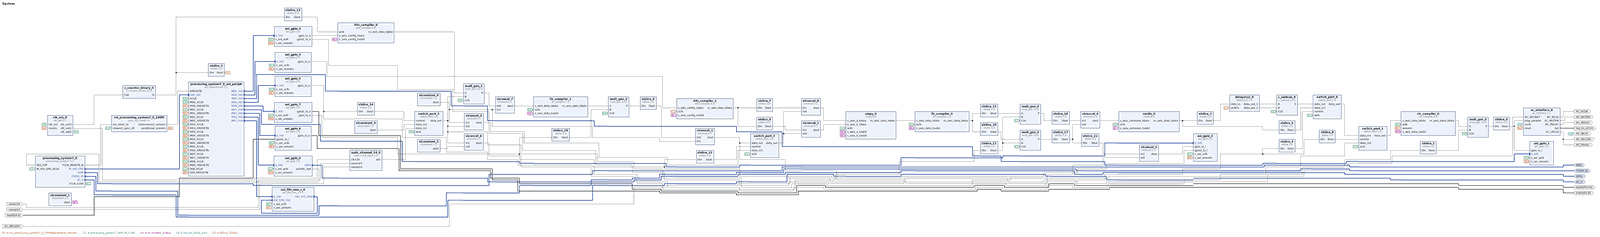
[diagram p0: block diagram of the top level, whole]
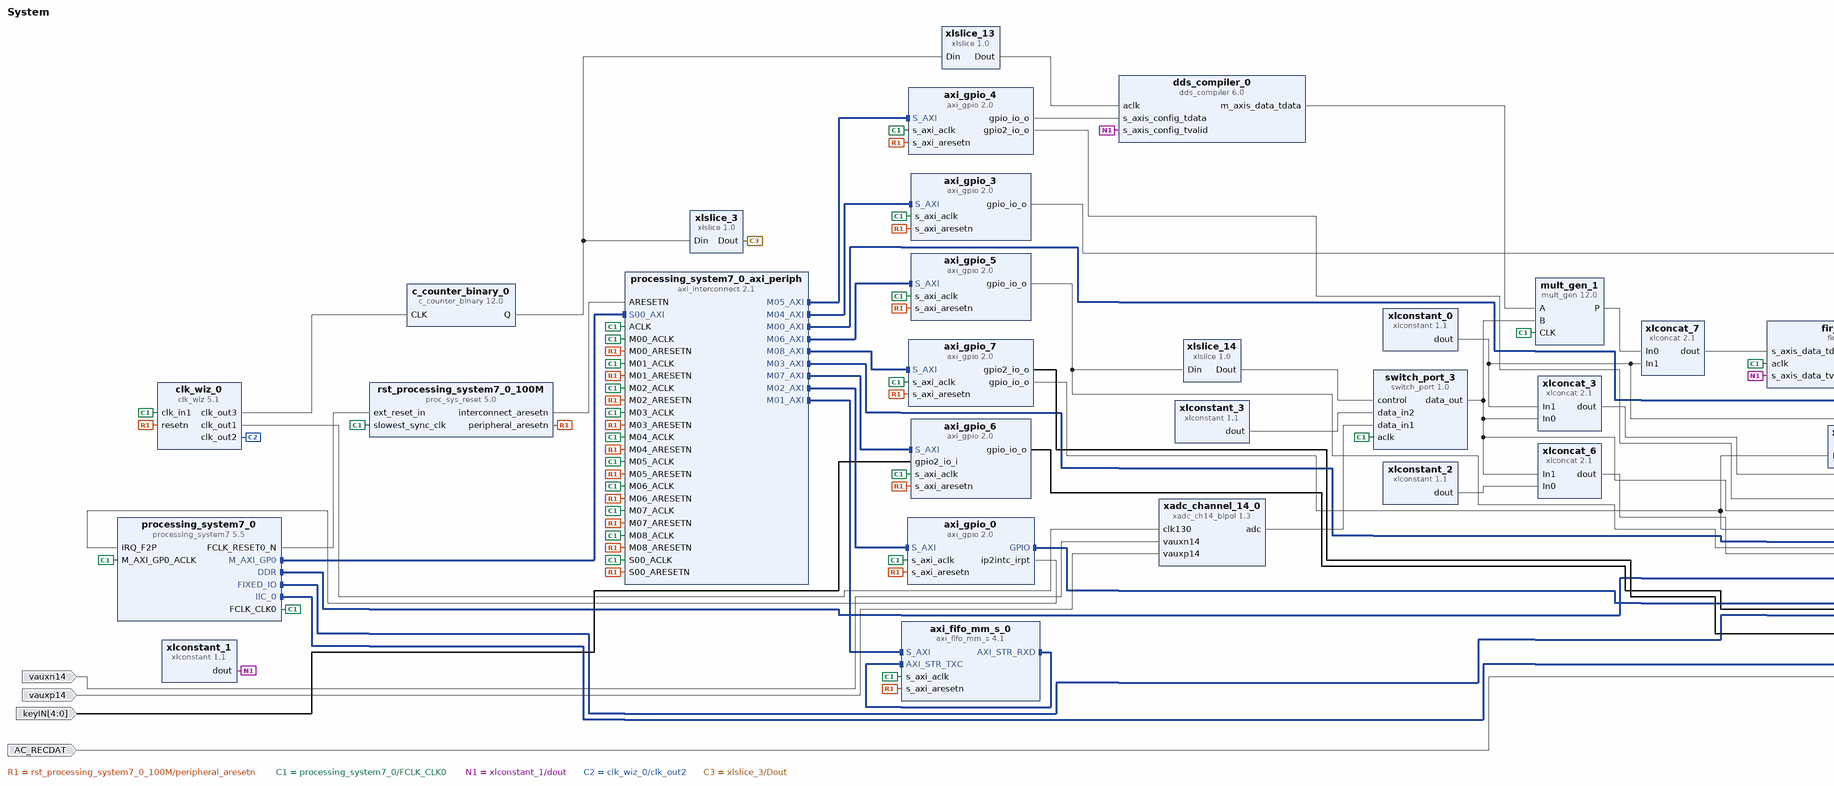
[diagram p1: block diagram of the top level, left part]
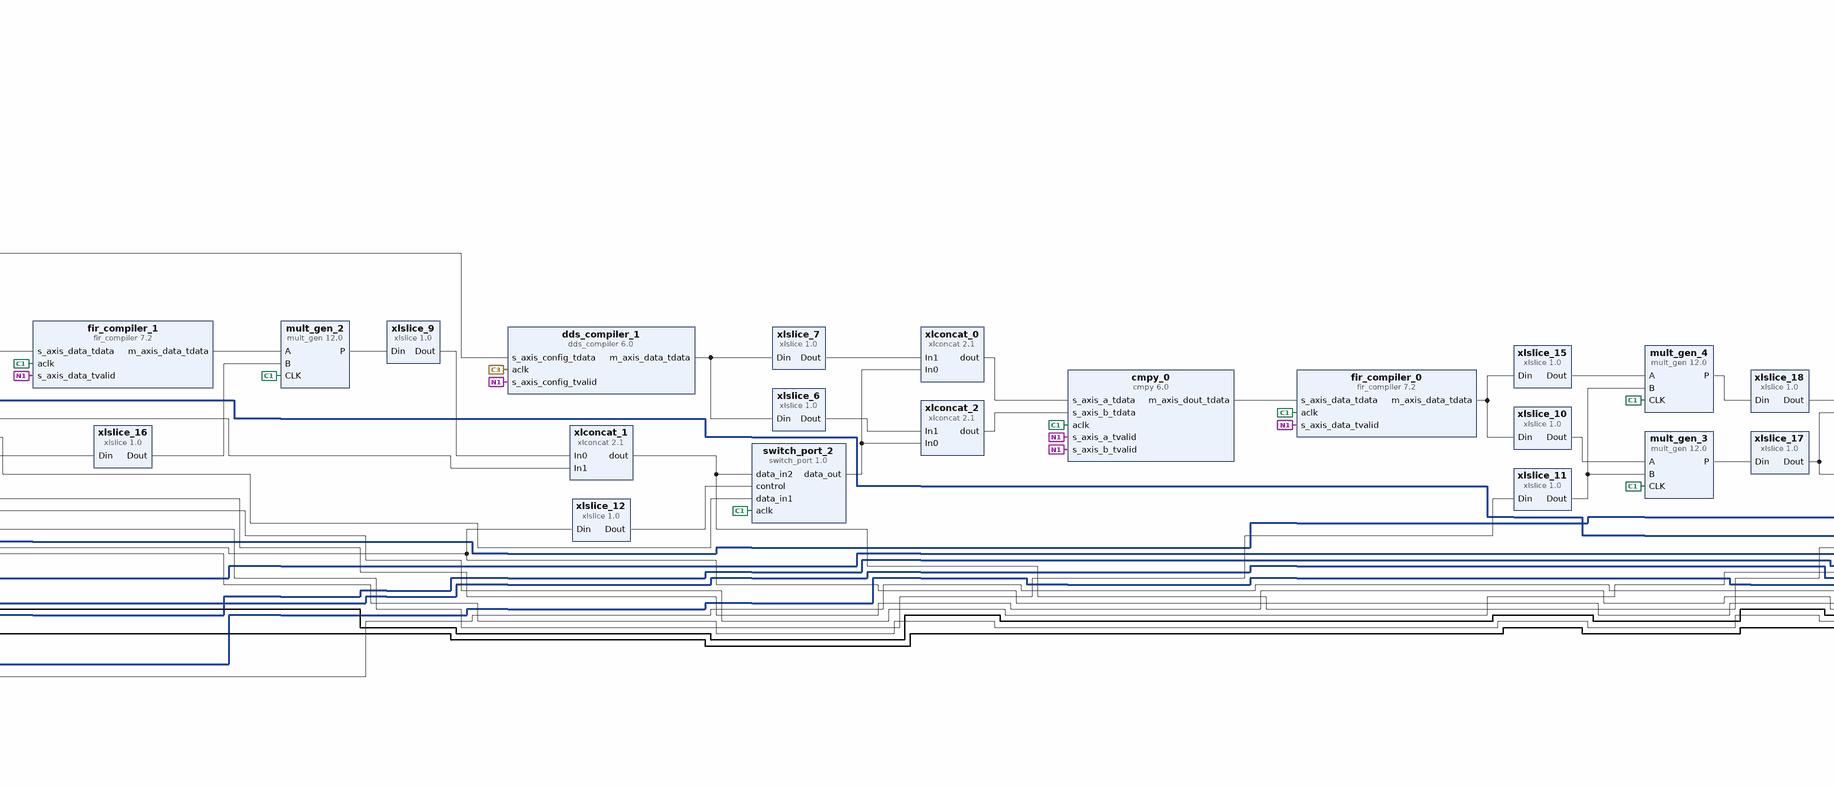
[diagram p2: block diagram of the top level, centre part]
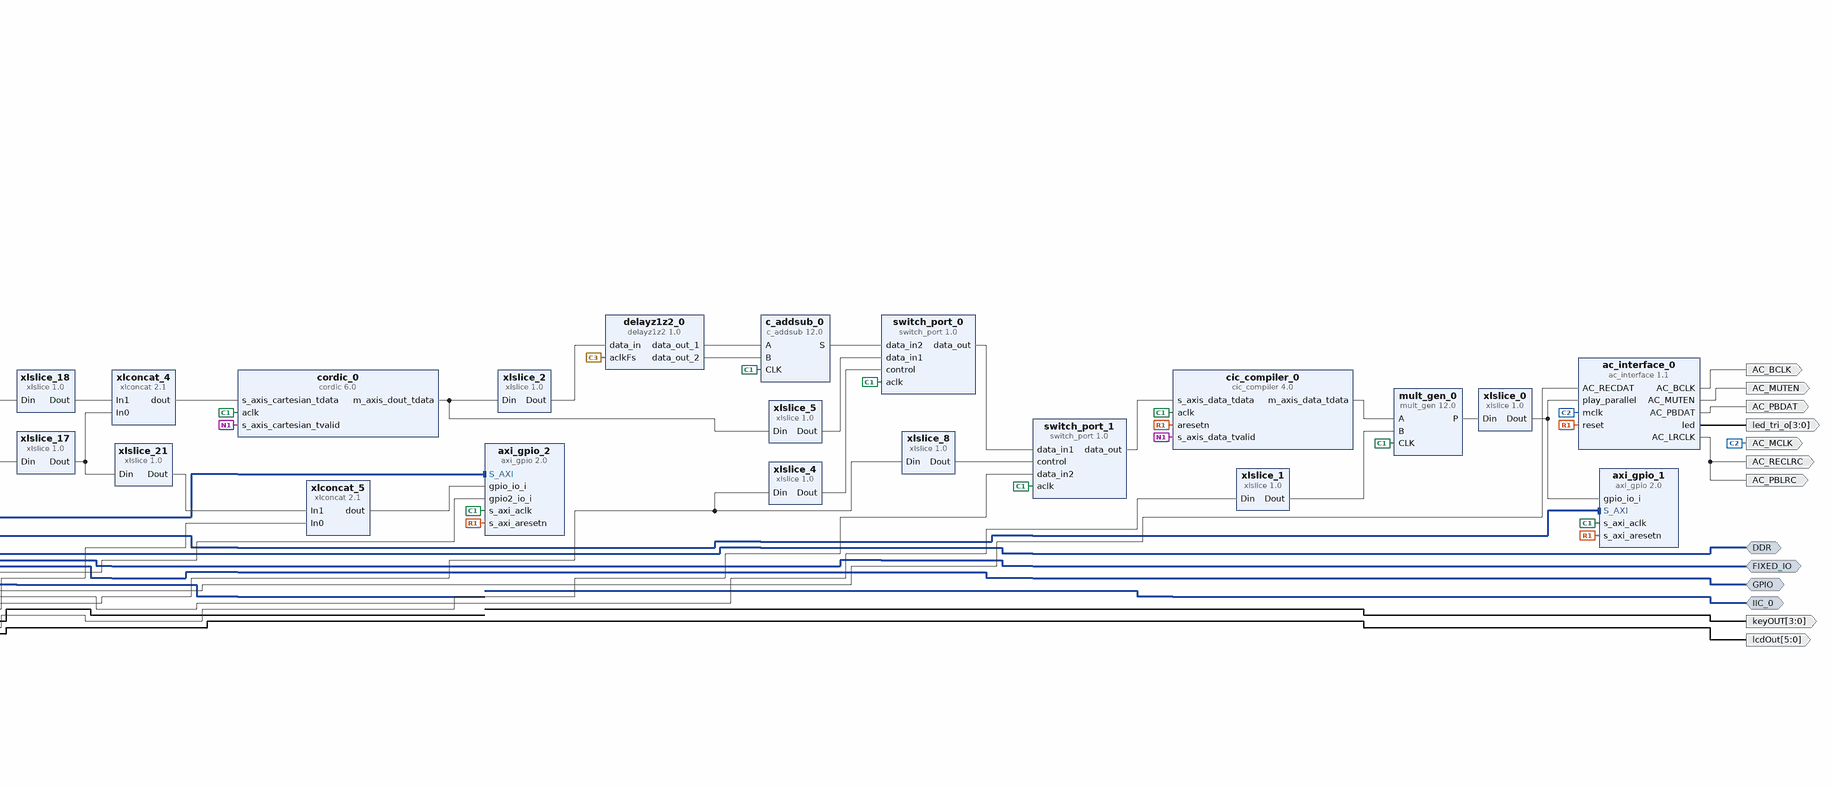
[diagram p3: block diagram of the top level, right part]
# Vivado block design System, Vivado 2014.4
create_bd_design System

create_bd_intf_port -mode Master -vlnv xilinx.com:interface:ddrx_rtl:1.0 DDR
create_bd_intf_port -mode Master -vlnv xilinx.com:display_processing_system7:fixedio_rtl:1.0 FIXED_IO
create_bd_intf_port -mode Master -vlnv xilinx.com:interface:gpio_rtl:1.0 GPIO
create_bd_intf_port -mode Master -vlnv xilinx.com:interface:iic_rtl:1.0 IIC_0
create_bd_port -dir I vauxn14
create_bd_port -dir I vauxp14
create_bd_port -dir O AC_MCLK
create_bd_port -dir O -from 3 -to 0 led_tri_o
create_bd_port -dir O AC_BCLK
create_bd_port -dir O AC_MUTEN
create_bd_port -dir O AC_PBDAT
create_bd_port -dir O AC_PBLRC
create_bd_port -dir O AC_RECLRC
create_bd_port -dir I AC_RECDAT
create_bd_port -dir O -from 3 -to 0 keyOUT
create_bd_port -dir I -from 4 -to 0 keyIN
create_bd_port -dir O -from 5 -to 0 lcdOut

create_bd_cell -type ip -vlnv xilinx.com:ip:axi_gpio:2.0 axi_gpio_0
set_property -dict {CONFIG.C_GPIO_WIDTH 4 CONFIG.C_ALL_INPUTS 1 CONFIG.C_INTERRUPT_PRESENT 1} [get_bd_cells axi_gpio_0]
create_bd_cell -type ip -vlnv xilinx.com:ip:processing_system7:5.5 processing_system7_0
set_property -dict [list \
  CONFIG.PCW_USE_FABRIC_INTERRUPT 1 \
  CONFIG.PCW_IRQ_F2P_INTR 1 \
  CONFIG.PCW_IMPORT_BOARD_PRESET {R:/Dropbox/Hobby/Programme/ZyBo/Dateien ZyBo/System.xml} \
  CONFIG.PCW_QSPI_PERIPHERAL_ENABLE 1 \
  CONFIG.PCW_ENET0_PERIPHERAL_ENABLE 0 \
  CONFIG.PCW_SD0_PERIPHERAL_ENABLE 0 \
  CONFIG.PCW_USB0_PERIPHERAL_ENABLE 0 \
  CONFIG.PCW_I2C0_PERIPHERAL_ENABLE 1 \
] [get_bd_cells processing_system7_0]
# 3 more settings of processing_system7_0 are not shown: defaults, MIO pin electricals, DDR timing, and values the tool derives
create_bd_cell -type ip -vlnv xilinx.com:ip:proc_sys_reset:5.0 rst_processing_system7_0_100M
create_bd_cell -type ip -vlnv xilinx.com:ip:axi_fifo_mm_s:4.1 axi_fifo_mm_s_0
set_property -dict {CONFIG.C_HAS_AXIS_TDEST false} [get_bd_cells axi_fifo_mm_s_0]
create_bd_cell -type ip -vlnv xilinx.com:ip:axi_interconnect:2.1 processing_system7_0_axi_periph
set_property -dict {CONFIG.NUM_MI 9} [get_bd_cells processing_system7_0_axi_periph]
create_bd_cell -type ip -vlnv xilinx.com:ip:axi_gpio:2.0 axi_gpio_1
set_property -dict {CONFIG.C_GPIO_WIDTH 32 CONFIG.C_ALL_INPUTS 1} [get_bd_cells axi_gpio_1]
create_bd_cell -type ip -vlnv xilinx.com:ip:axi_gpio:2.0 axi_gpio_3
set_property -dict {CONFIG.C_GPIO_WIDTH 16 CONFIG.C_ALL_INPUTS 0 CONFIG.C_ALL_OUTPUTS 1} [get_bd_cells axi_gpio_3]
create_bd_cell -type ip -vlnv xilinx.com:ip:axi_gpio:2.0 axi_gpio_2
set_property -dict [list \
  CONFIG.C_GPIO_WIDTH 32 \
  CONFIG.C_GPIO2_WIDTH 12 \
  CONFIG.C_IS_DUAL 1 \
  CONFIG.C_ALL_INPUTS 1 \
  CONFIG.C_ALL_INPUTS_2 1 \
] [get_bd_cells axi_gpio_2]
create_bd_cell -type ip -vlnv xilinx.com:ip:xlconstant:1.1 xlconstant_1
create_bd_cell -type ip -vlnv xilinx.com:ip:axi_gpio:2.0 axi_gpio_4
set_property -dict [list \
  CONFIG.C_GPIO_WIDTH 16 \
  CONFIG.C_GPIO2_WIDTH 32 \
  CONFIG.C_IS_DUAL 1 \
  CONFIG.C_ALL_OUTPUTS 1 \
  CONFIG.C_ALL_OUTPUTS_2 1 \
] [get_bd_cells axi_gpio_4]
create_bd_cell -type ip -vlnv xilinx.com:ip:axi_gpio:2.0 axi_gpio_5
set_property -dict {CONFIG.C_GPIO_WIDTH 4 CONFIG.C_ALL_OUTPUTS 1} [get_bd_cells axi_gpio_5]
create_bd_cell -type ip -vlnv xilinx.com:ip:clk_wiz:5.1 clk_wiz_0
set_property -dict [list \
  CONFIG.PRIMITIVE MMCM \
  CONFIG.CLKOUT2_USED true \
  CONFIG.CLKOUT3_USED true \
  CONFIG.NUM_OUT_CLKS 3 \
  CONFIG.CLKOUT1_REQUESTED_OUT_FREQ 130.000 \
  CONFIG.CLKOUT1_REQUESTED_PHASE 0.000 \
  CONFIG.CLKOUT2_REQUESTED_OUT_FREQ 12.288 \
  CONFIG.CLKOUT3_REQUESTED_OUT_FREQ 16.000 \
  CONFIG.USE_LOCKED false \
  CONFIG.USE_RESET true \
  CONFIG.RESET_TYPE ACTIVE_LOW \
  CONFIG.CLKOUT1_JITTER 224.856 \
  CONFIG.CLKOUT1_PHASE_ERROR 300.278 \
  CONFIG.CLKOUT2_JITTER 328.869 \
  CONFIG.CLKOUT2_PHASE_ERROR 300.278 \
  CONFIG.CLKOUT3_JITTER 312.084 \
  CONFIG.CLKOUT3_PHASE_ERROR 300.278 \
] [get_bd_cells clk_wiz_0]
create_bd_cell -type ip -vlnv Nolan:user:ac_interface:1.1 ac_interface_0
create_bd_cell -type ip -vlnv TD:user:xadc_ch14_bipol:1.3 xadc_channel_14_0
create_bd_cell -type ip -vlnv xilinx.com:ip:dds_compiler:6.0 dds_compiler_1
set_property -dict [list \
  CONFIG.DDS_Clock_Rate 2 \
  CONFIG.Parameter_Entry Hardware_Parameters \
  CONFIG.Noise_Shaping None \
  CONFIG.Phase_Width 16 \
  CONFIG.Output_Width 12 \
  CONFIG.Phase_Increment Programmable \
  CONFIG.Negative_Sine true \
  CONFIG.Has_Phase_Out false \
  CONFIG.Has_ARESETn false \
  CONFIG.PINC1 100000000000 \
] [get_bd_cells dds_compiler_1]
create_bd_cell -type ip -vlnv xilinx.com:ip:xlslice:1.0 xlslice_6
set_property -dict {CONFIG.DIN_FROM 15 CONFIG.DIN_WIDTH 32} [get_bd_cells xlslice_6]
create_bd_cell -type ip -vlnv xilinx.com:ip:xlslice:1.0 xlslice_7
set_property -dict {CONFIG.DIN_TO 16 CONFIG.DIN_FROM 31 CONFIG.DIN_WIDTH 32} [get_bd_cells xlslice_7]
create_bd_cell -type ip -vlnv xilinx.com:ip:xlslice:1.0 xlslice_3
set_property -dict {CONFIG.DIN_TO 2 CONFIG.DIN_FROM 2 CONFIG.DIN_WIDTH 8} [get_bd_cells xlslice_3]
create_bd_cell -type ip -vlnv xilinx.com:ip:cic_compiler:4.0 cic_compiler_0
set_property -dict [list \
  CONFIG.Filter_Type Decimation \
  CONFIG.Number_Of_Stages 3 \
  CONFIG.Sample_Rate_Changes Fixed \
  CONFIG.Fixed_Or_Initial_Rate 42 \
  CONFIG.Input_Sample_Frequency 2 \
  CONFIG.Clock_Frequency 100.0 \
  CONFIG.Input_Data_Width 32 \
  CONFIG.Quantization Truncation \
  CONFIG.Output_Data_Width 32 \
  CONFIG.HAS_ARESETN true \
] [get_bd_cells cic_compiler_0]
create_bd_cell -type ip -vlnv xilinx.com:ip:cordic:6.0 cordic_0
set_property -dict [list \
  CONFIG.Functional_Selection Translate \
  CONFIG.Pipelining_Mode Optimal \
  CONFIG.Phase_Format Scaled_Radians \
  CONFIG.Input_Width 32 \
  CONFIG.Output_Width 32 \
  CONFIG.Round_Mode Round_Pos_Neg_Inf \
] [get_bd_cells cordic_0]
create_bd_cell -type ip -vlnv xilinx.com:ip:xlslice:1.0 xlslice_5
set_property -dict {CONFIG.DIN_FROM 31 CONFIG.DIN_WIDTH 64} [get_bd_cells xlslice_5]
create_bd_cell -type ip -vlnv xilinx.com:ip:cmpy:6.0 cmpy_0
set_property -dict [list \
  CONFIG.APortWidth 12 \
  CONFIG.BPortWidth 12 \
  CONFIG.RoundMode Truncate \
  CONFIG.OutputWidth 24 \
] [get_bd_cells cmpy_0]
create_bd_cell -type ip -vlnv xilinx.com:ip:xlconcat:2.1 xlconcat_0
set_property -dict {CONFIG.IN0_WIDTH 16 CONFIG.IN1_WIDTH 16} [get_bd_cells xlconcat_0]
create_bd_cell -type ip -vlnv xilinx.com:ip:xlconcat:2.1 xlconcat_2
set_property -dict {CONFIG.IN0_WIDTH 16 CONFIG.IN1_WIDTH 16} [get_bd_cells xlconcat_2]
create_bd_cell -type ip -vlnv xilinx.com:ip:c_counter_binary:12.0 c_counter_binary_0
set_property -dict {CONFIG.Output_Width 8} [get_bd_cells c_counter_binary_0]
create_bd_cell -type ip -vlnv xilinx.com:ip:mult_gen:12.0 mult_gen_0
set_property -dict [list \
  CONFIG.PortAType Signed \
  CONFIG.PortAWidth 32 \
  CONFIG.PortBType Signed \
  CONFIG.PortBWidth 16 \
] [get_bd_cells mult_gen_0]
create_bd_cell -type ip -vlnv xilinx.com:ip:xlslice:1.0 xlslice_0
set_property -dict {CONFIG.DIN_FROM 31 CONFIG.DIN_WIDTH 48} [get_bd_cells xlslice_0]
create_bd_cell -type ip -vlnv xilinx.com:ip:xlslice:1.0 xlslice_1
set_property -dict {CONFIG.DIN_FROM 15} [get_bd_cells xlslice_1]
create_bd_cell -type ip -vlnv TD:user:switch_port:1.0 switch_port_0
set_property -dict {CONFIG.D_WIDTH 32} [get_bd_cells switch_port_0]
create_bd_cell -type ip -vlnv xilinx.com:ip:xlslice:1.0 xlslice_2
set_property -dict {CONFIG.DIN_TO 32 CONFIG.DIN_FROM 63 CONFIG.DIN_WIDTH 64} [get_bd_cells xlslice_2]
create_bd_cell -type ip -vlnv TD:user:delayz1z2:1.0 delayz1z2_0
set_property -dict {CONFIG.D_WIDTH 32} [get_bd_cells delayz1z2_0]
create_bd_cell -type ip -vlnv xilinx.com:ip:c_addsub:12.0 c_addsub_0
set_property -dict [list \
  CONFIG.A_Type Signed \
  CONFIG.B_Type Signed \
  CONFIG.A_Width 32 \
  CONFIG.B_Width 32 \
  CONFIG.Add_Mode Subtract \
  CONFIG.Out_Width 32 \
  CONFIG.CE false \
] [get_bd_cells c_addsub_0]
create_bd_cell -type ip -vlnv xilinx.com:ip:xlslice:1.0 xlslice_4
set_property -dict {CONFIG.DIN_WIDTH 4} [get_bd_cells xlslice_4]
create_bd_cell -type ip -vlnv xilinx.com:ip:axi_gpio:2.0 axi_gpio_6
set_property -dict [list \
  CONFIG.C_GPIO_WIDTH 4 \
  CONFIG.C_GPIO2_WIDTH 5 \
  CONFIG.C_IS_DUAL 1 \
  CONFIG.C_ALL_INPUTS_2 1 \
  CONFIG.C_ALL_OUTPUTS 1 \
] [get_bd_cells axi_gpio_6]
create_bd_cell -type ip -vlnv xilinx.com:ip:axi_gpio:2.0 axi_gpio_7
set_property -dict [list \
  CONFIG.C_GPIO_WIDTH 16 \
  CONFIG.C_GPIO2_WIDTH 6 \
  CONFIG.C_IS_DUAL 1 \
  CONFIG.C_ALL_OUTPUTS 1 \
  CONFIG.C_ALL_OUTPUTS_2 1 \
] [get_bd_cells axi_gpio_7]
create_bd_cell -type ip -vlnv TD:user:switch_port:1.0 switch_port_1
set_property -dict {CONFIG.D_WIDTH 32} [get_bd_cells switch_port_1]
create_bd_cell -type ip -vlnv xilinx.com:ip:xlslice:1.0 xlslice_8
set_property -dict {CONFIG.DIN_TO 1 CONFIG.DIN_FROM 1 CONFIG.DIN_WIDTH 4} [get_bd_cells xlslice_8]
create_bd_cell -type ip -vlnv xilinx.com:ip:xlconcat:2.1 xlconcat_6
set_property -dict {CONFIG.IN0_WIDTH 20 CONFIG.IN1_WIDTH 12} [get_bd_cells xlconcat_6]
create_bd_cell -type ip -vlnv xilinx.com:ip:xlconstant:1.1 xlconstant_2
set_property -dict {CONFIG.CONST_WIDTH 20 CONFIG.CONST_VAL 00000000000000000000} [get_bd_cells xlconstant_2]
create_bd_cell -type ip -vlnv xilinx.com:ip:fir_compiler:7.2 fir_compiler_1
set_property -dict [list \
  CONFIG.CoefficientSource Vector \
  CONFIG.CoefficientVector {-3.6422104847778761e-06, -1.7235236456349554e-06, -6.5605630122715771e-08, 1.3009683366130124e-06, 2.3545936956420433e-06, 3.0830197019838887e-06, 3.4835294156239235e-06, 3.5629129955667498e-06, 3.3372344875325201e-06, 2.8313960502360503e-06, 2.0785072865694044e-06, 1.1190709773849026e-06, -2.3035669289843903e-20, -1.2265165052400941e-06, -2.5042766338218733e-06, -3.7744350823556351e-06, -4.9769522293226605e-06, -6.0520948348810563e-06, -6.941958766077525e-06, -7.5919831410353323e-06, -7.9524247876477664e-06, -7.9797619524209215e-06, -7.637996789280011e-06, -6.8998273140827434e-06, -5.7476612272222929e-06, -4.1744462737819984e-06, -2.1842946083839896e-06, 2.0711806945961305e-07, 2.9723940834723496e-06, 6.0725073535803546e-06, 9.4571557486109325e-06, 1.3065374180715241e-05, 1.6826405379823742e-05, 2.0660820134894325e-05, 2.4481873598435841e-05, 2.8197079115782801e-05, 3.1709976058339652e-05, 3.4922063409739145e-05, 3.7734866474867545e-05, 4.0052100151439553e-05, 4.1781888815897691e-05, 4.2839000117721148e-05, 4.3147047928795297e-05, 4.2640618427624782e-05, 4.126727287052994e-05, 3.8989381058840429e-05, 3.5785740882826189e-05, 3.1652941623720675e-05, 2.6606431921308062e-05, 2.0681257444575258e-05, 1.3932438296593733e-05, 6.4349619829956904e-06, -1.71662570148009e-06, -1.0409042357418418e-05, -1.9511506049700093e-05, -2.8877382507870692e-05, -3.8346228888137883e-05, -4.774621211334551e-05, -5.6896871457633397e-05, -6.561218692445845e-05, -7.3703907250549069e-05, -8.0985084223964755e-05, -8.7273753597646284e-05, -9.239669736913084e-05, -9.6193217729953254e-05, -9.8518849697719474e-05, -9.9248937445209291e-05, -9.8281998728576636e-05, -9.554280266153747e-05, -9.0985088429025425e-05, -8.4593856398705567e-05, -7.6387168458873559e-05, -6.6417401242984365e-05, -5.4771904119677069e-05, -4.1573023327333199e-05, -2.6977464278693313e-05, -1.1174975690321365e-05, 5.6136483859398614e-06, 2.3139239549968569e-05, 4.1127576629809569e-05, 5.9283321971099997e-05, 7.7294523278261551e-05, 9.4837618991704383e-05, 0.00011158287303027423, 0.00012720015353816415, 0.00014136496030708613, 0.00015376459703940958, 0.00016410437779807935, 0.0001721137520509807, 0.00017755222982757064, 0.00018021498779602173, 0.00017993803863347753, 0.0001766028499522879, 0.00017014030526917186, 0.00016053390802420962, 0.00014782214038778257, 0.00013209990140495651, 0.00011351896374162415, 9.2287404694796181e-05, 6.8667984949938584e-05, 4.2975467513605548e-05, 1.5572888990203144e-05, -1.313318444862831e-05, -4.2698363811265622e-05, -7.2647034244331191e-05, -0.0001024797505048134, -0.00013168132117561868, -0.00015972945528416443, -0.00018610383028489836, -0.00021029542788216383, -0.00023181597420967307, -0.00025020731371743729, -0.00026505054197039127, -0.00027597472160703878, -0.00028266500805609093, -0.0002848700173180952, -0.00028240827717744647, -0.0002751736155424436, -0.00026313935507583995, -0.00024636120166932551, -0.00022497873536358163, -0.00019921543569277297, -0.00016937719875610247, -0.00013584933015852344, -9.9092025845925625e-05, -5.9634381282109975e-05, -1.8066997846714812e-05, 2.4966716768213299e-05, 6.8780430567221825e-05, 0.00011265580287305414, 0.00015585426171465928, 0.00019762945072104827, 0.00023724013594158896, 0.00027396334919782187, 0.00030710753461056425, 0.00033602545912352224, 0.00036012664637272227, 0.00037888909626274618, 0.00039187006015561839, 0.00039871565361962067, 0.0003991691050991078, 0.00039307745944120506, 0.0003803965796546894, 0.0003611943182028328, 0.00033565176009223656, 0.00030406247349203829, 0.00026682973902068536, 0.00022446176553937318, 0.00017756493762222323, 0.00012683517713695319, 7.3047537856419796e-05, 1.7044187021416604e-05, -4.0279039407094956e-05, -9.7987291100309828e-05, -0.00015512232412096398, -0.00021071882244896704, -0.00026382113674286743, -0.00031350014389790599, -0.00035886992337357568, -0.00039910394424031061, -0.00043345046057755417, -0.00046124682227795705, -0.00048193242339886308, -0.00049506003076606132, -0.0005003052612805851, -0.00049747400690652204, -0.00048650764112653024, -0.00046748587915084713, -0.00044062720568252957, -0.00040628682783419671, -0.00036495215606102081, -0.00031723586188060879, -0.0002638666068261048, -0.00020567758164808186, -0.00014359303737456283, -7.8613029612268855e-05, -1.1796633622672249e-05, 5.5756080511967759e-05, 0.00012292299657709824, 0.00018857948759914097, 0.00025161818573042285, 0.00031096862595286773, 0.00036561640112453938, 0.00041462147097205687, 0.00045713527956680201, 0.00049241635447406476, 0.00051984408585952369, 0.00053893041497507673, 0.00054932919810108511, 0.00055084305355479794, 0.00054342754504152415, 0.00052719260359175503, 0.0005024011416841492, 0.00046946486593271226, 0.00042893734790789656, 0.00038150446523611554, 0.00032797237604971323, 0.00026925323812874871, 0.00020634892871573084, 0.00014033306108296811, 7.2331628656130471e-05, 3.5026361096546596e-06, -6.4984901275665698e-05, -0.00013197219406484807, -0.00019633174796397694, -0.00025698786376859362, -0.00031293617443017087, -0.00036326184214679368, -0.0004071560623629581, -0.00044393055267872211, -0.00047302974237219147, -0.00049404042184575316, -0.00050669866000412772, -0.00051089385043876694, -0.00050666980331211893, -0.00049422285791594347, -0.00047389704987579786, -0.00044617642571340496, -0.00041167465477643539, -0.00037112214323374164, -0.00032535090578549177, -0.00027527749688717988, -0.0002218843436547153, -0.00016619985633164818, -0.00010927771851122391, -5.2175777609752957e-05, 4.0650340657823936e-06, 5.8441316206067154e-05, 0.00011000693163339093, 0.00015789144448430115, 0.00020131688327804253, 0.00023961247983200138, 0.00027222707559768138, 0.00029873893432850909, 0.00031886275314372718, 0.0003324537219796716, 0.0003395085429686751, 0.00034016338521545718, 0.0003346888154452746, 0.00032348180973278931, 0.00030705501462940845, 0.00028602348615000154, 0.00026108919096157635, 0.0002330236045125114, 0.00020264878462475185, 0.00017081733523894091, 0.00013839170269476614, 0.0001062232654516453, 7.5131686995882256e-05, 4.5885000522150403e-05, 1.9180882706859734e-05, -4.3704473941624384e-06, -2.4261299282590291e-05, -4.0099186928975313e-05, -5.161679345132192e-05, -5.867896457203439e-05, -6.1286533568400613e-05, -5.957684838780486e-05, -5.3820943442733242e-05, -4.4417372863673183e-05, -3.188279712590431e-05, -1.6839489389626262e-05, 1.7035977866319725e-19, 1.785071419707591e-05, 3.5875326284093986e-05, 5.3205916090441247e-05, 6.8967014319657621e-05, 8.2299402547212936e-05, 9.2384129662246667e-05, 9.8466188510870964e-05, 9.9877291439654737e-05, 9.6057190484819099e-05, 8.6573007207764726e-05, 7.1136068489170449e-05, 4.9615787555031394e-05, 2.2050183459279476e-05, -1.1347303713563979e-05, -5.0184971668441453e-05, -9.3894177879655822e-05, -0.00014173492718119735, -0.00019280573634100585, -0.0002460576933438418, -0.00030031253479878811, -0.00035428447188723297, -0.00040660540556029329, -0.00045585308724247793, -0.00050058170399799233, -0.00053935429876018567, -0.00057077637846231677, -0.00059353001720833186, -0.00060640772924064551, -0.00060834536840879137, -0.00059845330785892822, -0.00057604516619881867, -0.0005406633745888758, -0.0004921009228933713, -0.00043041868170329902, -0.00035595776990300626, -0.00026934652337804403, -0.00017150171804105731, -6.3623807905242771e-05, 5.2813945462671306e-05, 0.00017608245425852417, 0.0003042197735422461, 0.00043505980882920897, 0.00056626638790101356, 0.00069537220147877917, 0.00081982200274054997, 0.00093701934989814635, 0.001044376081531671, 0.0011393636332995111, 0.0012195652389728794, 0.0012827280102038594, 0.0013268138594452956, 0.0013500482200881959, 0.0013509655278956428, 0.0013284504585359281, 0.0012817739673975713, 0.0012106232494437756, 0.0011151248277655999, 0.00099586008845404866, 0.00085387270478037738, 0.00069066753343986753, 0.00050820071743717943, 0.00030886089143959612, 9.5441553221181318e-05, -0.00012889516390801842, -0.00036066291126215491, -0.00059610316260838309, -0.00083124413260076595, -0.0010619656862389793, -0.0012840692100455269, -0.0014933512917156969, -0.0016856799496040202, -0.0018570720690427691, -0.0020037706412711727, -0.0021223203644263598, -0.0022096401559116982, -0.0022630911423519888, -0.0022805387376094201, -0.0022604074908010689, -0.0022017274842403827, -0.0021041711845178543, -0.0019680797968311971, -0.0017944783409812675, -0.0015850788545233214, -0.0013422713313493812, -0.0010691022190599357, -0.00076924052213926176, -0.00044693178621543772, -0.00010694046742694325, 0.0002455185841006355, 0.00060485858069667228, 0.00096520804277707177, 0.0013205054944459146, 0.0016646001014652141, 0.0019913565992653597, 0.0022947627407832222, 0.0025690374056221567, 0.0028087374555899399, 0.0030088613988076109, 0.0031649479364287626, 0.0032731675130848806, 0.003330405074357981, 0.0033343323511103987, 0.0032834681399601614, 0.0031772252295342259, 0.0030159428307106858, 0.002800903602655982, 0.0025343346213365266, 0.0022193919091377814, 0.0018601284286690824, 0.0014614457358653632, 0.0010290297819859308, 0.00056927164578181831, 8.917426063972028e-05, -0.00040375352835577604, -0.00090161399088786775, -0.001396246806633625, -0.0018793626142045495, -0.0023426816305274515, -0.0027780750248181624, -0.0031777066374071004, -0.0035341725808398458, -0.0038406362505769235, -0.0040909563061903419, -0.0042798052613673698, -0.004402776441663544, -0.0044564772313899267, -0.0044386067330923224, -0.0043480162018535275, -0.0041847508884896873, -0.0039500722263324161, -0.0036464596208211153, -0.003277591444200775, -0.0028483051934405277, -0.0023645371319508551, -0.001833242098463958, -0.0012622945231313867, -0.00066037203507797687, -3.6823371049750519e-05, 0.00059847740463359305, 0.0012352880885487395, 0.0018631644204629846, 0.0024716323509306032, 0.0030503636361604433, 0.0035893518003118851, 0.0040790854537421329, 0.004510715955895887, 0.0048762164642287701, 0.0051685295155966945, 0.0053817004428035782, 0.0055109941344379113, 0.005552992897806113, 0.0055056734788930068, 0.0053684616252550922, 0.0051422629422604891, 0.0048294691841705853, 0.0044339395327080994, 0.0039609568400380294, 0.0034171592432469915, 0.0028104479859992356, 0.0021498727025678717, 0.0014454958224523651, 0.00070823813306799643, -5.0292113368517406e-05, -0.00081798385106839229, -0.0015824186436939108, -0.0023310737323256991, -0.0030515293334839174, -0.0037316767202704372, -0.004359923566222181, -0.00492539303812271, -0.0054181131913403676, -0.0058291933487222636, -0.0061509843300908357, -0.0063772196413394502, -0.0065031350263786928, -0.0065255641271674695, -0.0064430083813168428, -0.0062556797070334727, -0.0059655149745387924, -0.0055761617340531928, -0.0050929351550192672, -0.004522746621192333, -0.0038740049131212712, -0.0031564913849277923, -0.0023812109978445239, -0.0015602215006441276, -0.00070644343925179364, 0.00016654597259427149, 0.0010447317891763785, 0.0019138894966463271, 0.0027598186396485375, 0.0035685780216661764, 0.0043267185318089027, 0.0050215096596183881, 0.0056411558357677789, 0.0061749988794586007, 0.0066137030408969909, 0.0069494193963481081, 0.0071759266797213651, 0.0072887460132054502, 0.0072852274239882057, 0.0071646064975629687, 0.0069280300128205406, 0.0065785499217461746, 0.0061210855683267529, 0.0055623545781701006, 0.0049107733831492226, 0.0041763288649304198, 0.0033704230985240583, 0.0025056936433445801, 0.0015958122565047765, 0.00065526528365349201, -0.00030088069018043625, -0.001257224079439064, -0.002198280372654903, -0.0031087368532989367, -0.0039737057123634296, -0.0047789713053327052, -0.0055112273856419078, -0.0061583002974234602, -0.0067093543300127002, -0.0071550757218457346, -0.0074878321474098862, -0.0077018049221069199, -0.0077930916095963051, -0.0077597772068741704, -0.0076019726057550618, -0.0073218195767077296, -0.006923462082863493, -0.0064129842988959853, -0.0057983162716800374, -0.00508910870754355, -0.0042965788951183437, -0.0034333302642471407, -0.0025131485316288384, -0.0015507777850876361, -0.00056168020356535593, 0.00043821660685896088, 0.0014327804643853789, 0.0024059393083679221, 0.0033419453276296303, 0.0042256341089074133, 0.0050426744716374153, 0.0057798048064031755, 0.0064250519565807861, 0.0069679289723106564, 0.0073996084180253368, 0.007713068323407994, 0.0079032083259105365, 0.0079669340530301117, 0.0079032083259105365, 0.007713068323407994, 0.0073996084180253368, 0.0069679289723106564, 0.0064250519565807861, 0.0057798048064031755, 0.0050426744716374153, 0.0042256341089074133, 0.0033419453276296303, 0.0024059393083679221, 0.0014327804643853789, 0.00043821660685896088, -0.00056168020356535593, -0.0015507777850876361, -0.0025131485316288384, -0.0034333302642471407, -0.0042965788951183437, -0.00508910870754355, -0.0057983162716800374, -0.0064129842988959853, -0.006923462082863493, -0.0073218195767077296, -0.0076019726057550627, -0.0077597772068741704, -0.0077930916095963051, -0.0077018049221069199, -0.0074878321474098871, -0.0071550757218457363, -0.0067093543300127002, -0.0061583002974234602, -0.0055112273856419078, -0.0047789713053327052, -0.0039737057123634296, -0.0031087368532989367, -0.002198280372654903, -0.001257224079439064, -0.00030088069018043625, 0.00065526528365349201, 0.0015958122565047765, 0.0025056936433445801, 0.0033704230985240583, 0.0041763288649304198, 0.0049107733831492226, 0.0055623545781701015, 0.0061210855683267529, 0.0065785499217461754, 0.0069280300128205415, 0.0071646064975629687, 0.0072852274239882065, 0.0072887460132054511, 0.007175926679721366, 0.0069494193963481081, 0.0066137030408969909, 0.0061749988794586007, 0.0056411558357677789, 0.0050215096596183881, 0.0043267185318089027, 0.0035685780216661769, 0.0027598186396485375, 0.0019138894966463271, 0.0010447317891763785, 0.00016654597259427149, -0.00070644343925179364, -0.0015602215006441278, -0.0023812109978445239, -0.0031564913849277923, -0.0038740049131212712, -0.004522746621192333, -0.0050929351550192672, -0.0055761617340531928, -0.0059655149745387924, -0.0062556797070334727, -0.0064430083813168428, -0.0065255641271674695, -0.0065031350263786928, -0.0063772196413394502, -0.0061509843300908357, -0.0058291933487222645, -0.0054181131913403676, -0.00492539303812271, -0.0043599235662221819, -0.0037316767202704372, -0.0030515293334839179, -0.0023310737323256996, -0.0015824186436939108, -0.00081798385106839229, -5.0292113368517413e-05, 0.00070823813306799654, 0.0014454958224523651, 0.0021498727025678717, 0.0028104479859992356, 0.0034171592432469915, 0.0039609568400380303, 0.0044339395327080994, 0.0048294691841705853, 0.00514226294226049, 0.0053684616252550922, 0.0055056734788930077, 0.005552992897806113, 0.0055109941344379122, 0.0053817004428035782, 0.0051685295155966945, 0.0048762164642287701, 0.004510715955895887, 0.0040790854537421329, 0.0035893518003118851, 0.0030503636361604433, 0.0024716323509306037, 0.001863164420462985, 0.0012352880885487397, 0.00059847740463359305, -3.6823371049750519e-05, -0.00066037203507797698, -0.0012622945231313869, -0.0018332420984639582, -0.0023645371319508555, -0.0028483051934405277, -0.003277591444200775, -0.0036464596208211153, -0.003950072226332417, -0.0041847508884896873, -0.0043480162018535284, -0.0044386067330923233, -0.0044564772313899275, -0.004402776441663544, -0.0042798052613673707, -0.0040909563061903428, -0.0038406362505769244, -0.0035341725808398466, -0.0031777066374071013, -0.0027780750248181624, -0.0023426816305274515, -0.0018793626142045495, -0.0013962468066336252, -0.00090161399088786785, -0.00040375352835577609, 8.917426063972028e-05, 0.00056927164578181831, 0.0010290297819859308, 0.0014614457358653637, 0.0018601284286690822, 0.0022193919091377814, 0.0025343346213365274, 0.0028009036026559828, 0.0030159428307106858, 0.0031772252295342264, 0.0032834681399601618, 0.0033343323511103996, 0.0033304050743579805, 0.003273167513084881, 0.0031649479364287635, 0.0030088613988076105, 0.0028087374555899403, 0.0025690374056221571, 0.0022947627407832231, 0.0019913565992653597, 0.0016646001014652145, 0.0013205054944459148, 0.00096520804277707198, 0.00060485858069667228, 0.0002455185841006355, -0.00010694046742694328, -0.00044693178621543772, -0.00076924052213926187, -0.0010691022190599359, -0.0013422713313493817, -0.001585078854523321, -0.0017944783409812675, -0.0019680797968311976, -0.0021041711845178547, -0.0022017274842403831, -0.0022604074908010694, -0.0022805387376094209, -0.0022630911423519888, -0.0022096401559116986, -0.0021223203644263602, -0.0020037706412711735, -0.0018570720690427687, -0.0016856799496040207, -0.0014933512917156974, -0.0012840692100455275, -0.0010619656862389795, -0.00083124413260076617, -0.00059610316260838331, -0.0003606629112621548, -0.00012889516390801842, 9.5441553221181345e-05, 0.00030886089143959629, 0.00050820071743717943, 0.00069066753343986753, 0.0008538727047803776, 0.00099586008845404909, 0.0011151248277655999, 0.0012106232494437758, 0.0012817739673975715, 0.0013284504585359279, 0.0013509655278956428, 0.0013500482200881963, 0.001326813859445296, 0.0012827280102038594, 0.0012195652389728794, 0.0011393636332995116, 0.0010443760815316708, 0.00093701934989814635, 0.00081982200274055008, 0.00069537220147877939, 0.00056626638790101345, 0.00043505980882920913, 0.00030421977354224615, 0.00017608245425852425, 5.2813945462671306e-05, -6.3623807905242771e-05, -0.0001715017180410574, -0.00026934652337804398, -0.00035595776990300632, -0.00043041868170329907, -0.00049210092289337141, -0.00054066337458887569, -0.00057604516619881867, -0.00059845330785892833, -0.00060834536840879169, -0.00060640772924064551, -0.00059353001720833197, -0.00057077637846231699, -0.00053935429876018556, -0.00050058170399799233, -0.00045585308724247804, -0.00040660540556029334, -0.00035428447188723297, -0.00030031253479878816, -0.00024605769334384186, -0.00019280573634100593, -0.00014173492718119735, -9.3894177879655835e-05, -5.0184971668441473e-05, -1.1347303713563977e-05, 2.205018345927948e-05, 4.9615787555031401e-05, 7.1136068489170476e-05, 8.6573007207764699e-05, 9.6057190484819113e-05, 9.9877291439654778e-05, 9.8466188510871005e-05, 9.2384129662246667e-05, 8.2299402547212949e-05, 6.8967014319657661e-05, 5.320591609044124e-05, 3.5875326284093986e-05, 1.7850714197075913e-05, 1.7035977866319734e-19, -1.6839489389626262e-05, -3.1882797125904316e-05, -4.4417372863673197e-05, -5.3820943442733269e-05, -5.9576848387804873e-05, -6.1286533568400626e-05, -5.8678964572034411e-05, -5.1616793451321907e-05, -4.0099186928975313e-05, -2.4261299282590295e-05, -4.37044739416244e-06, 1.9180882706859737e-05, 4.588500052215041e-05, 7.5131686995882297e-05, 0.00010622326545164538, 0.00013839170269476617, 0.00017081733523894096, 0.00020264878462475193, 0.00023302360451251135, 0.00026108919096157635, 0.0002860234861500016, 0.00030705501462940872, 0.00032348180973278931, 0.0003346888154452747, 0.00034016338521545734, 0.00033950854296867526, 0.0003324537219796716, 0.00031886275314372729, 0.0002987389343285092, 0.00027222707559768132, 0.00023961247983200138, 0.00020131688327804255, 0.00015789144448430129, 0.00011000693163339093, 5.8441316206067161e-05, 4.0650340657823944e-06, -5.2175777609752998e-05, -0.00010927771851122392, -0.00016619985633164821, -0.00022188434365471541, -0.00027527749688717988, -0.00032535090578549177, -0.0003711221432337417, -0.00041167465477643571, -0.00044617642571340502, -0.00047389704987579808, -0.00049422285791594369, -0.00050666980331211925, -0.00051089385043876694, -0.00050669866000412783, -0.00049404042184575338, -0.00047302974237219125, -0.00044393055267872211, -0.00040715606236295821, -0.00036326184214679395, -0.00031293617443017087, -0.00025698786376859373, -0.00019633174796397705, -0.00013197219406484815, -6.4984901275665712e-05, 3.5026361096546609e-06, 7.2331628656130512e-05, 0.00014033306108296808, 0.00020634892871573084, 0.00026925323812874888, 0.0003279723760497135, 0.00038150446523611554, 0.00042893734790789661, 0.00046946486593271253, 0.00050240114168414909, 0.00052719260359175503, 0.00054342754504152436, 0.00055084305355479815, 0.000549329198101085, 0.00053893041497507673, 0.00051984408585952402, 0.0004924163544740652, 0.00045713527956680201, 0.00041462147097205698, 0.00036561640112453954, 0.00031096862595286762, 0.00025161818573042285, 0.00018857948759914105, 0.00012292299657709832, 5.5756080511967745e-05, -1.1796633622672253e-05, -7.861302961226891e-05, -0.00014359303737456296, -0.00020567758164808186, -0.00026386660682610485, -0.00031723586188060911, -0.0003649521560610207, -0.00040628682783419671, -0.00044062720568252968, -0.00046748587915084735, -0.00048650764112653002, -0.00049747400690652226, -0.00050030526128058543, -0.00049506003076606186, -0.00048193242339886308, -0.00046124682227795716, -0.00043345046057755449, -0.0003991039442403105, -0.00035886992337357573, -0.0003135001438979061, -0.00026382113674286765, -0.00021071882244896699, -0.00015512232412096401, -9.7987291100309882e-05, -4.0279039407095004e-05, 1.7044187021416604e-05, 7.3047537856419823e-05, 0.00012683517713695322, 0.00017756493762222314, 0.0002244617655393732, 0.00026682973902068552, 0.00030406247349203851, 0.00033565176009223656, 0.00036119431820283286, 0.00038039657965468961, 0.00039307745944120544, 0.0003991691050991078, 0.00039871565361962073, 0.00039187006015561866, 0.00037888909626274597, 0.00036012664637272227, 0.00033602545912352245, 0.00030710753461056457, 0.00027396334919782176, 0.00023724013594158904, 0.00019762945072104835, 0.0001558542617146595, 0.00011265580287305414, 6.8780430567221852e-05, 2.4966716768213319e-05, -1.8066997846714802e-05, -5.9634381282109996e-05, -9.9092025845925707e-05, -0.00013584933015852355, -0.00016937719875610241, -0.00019921543569277299, -0.00022497873536358171, -0.00024636120166932583, -0.00026313935507583995, -0.00027517361554244376, -0.00028240827717744668, -0.00028487001731809509, -0.00028266500805609098, -0.000275974721607039, -0.00026505054197039149, -0.00025020731371743724, -0.00023181597420967313, -0.00021029542788216396, -0.00018610383028489855, -0.00015972945528416443, -0.00013168132117561874, -0.00010247975050481345, -7.2647034244331164e-05, -4.2698363811265636e-05, -1.3133184448628313e-05, 1.5572888990203157e-05, 4.2975467513605548e-05, 6.8667984949938611e-05, 9.2287404694796235e-05, 0.00011351896374162429, 0.00013209990140495651, 0.00014782214038778263, 0.00016053390802420975, 0.00017014030526917186, 0.00017660284995228793, 0.00017993803863347756, 0.00018021498779602195, 0.00017755222982757064, 0.00017211375205098079, 0.00016410437779807948, 0.0001537645970394098, 0.00014136496030708613, 0.0001272001535381642, 0.0001115828730302743, 9.4837618991704342e-05, 7.7294523278261578e-05, 5.9283321971100044e-05, 4.1127576629809617e-05, 2.3139239549968569e-05, 5.6136483859398639e-06, -1.1174975690321373e-05, -2.697746427869334e-05, -4.1573023327333199e-05, -5.4771904119677089e-05, -6.641740124298442e-05, -7.6387168458873531e-05, -8.4593856398705567e-05, -9.0985088429025506e-05, -9.5542802661537578e-05, -9.8281998728576636e-05, -9.9248937445209332e-05, -9.8518849697719568e-05, -9.6193217729953335e-05, -9.239669736913084e-05, -8.7273753597646325e-05, -8.0985084223964837e-05, -7.3703907250549069e-05, -6.5612186924458491e-05, -5.6896871457633431e-05, -4.7746212113345558e-05, -3.8346228888137883e-05, -2.8877382507870709e-05, -1.9511506049700103e-05, -1.0409042357418413e-05, -1.71662570148009e-06, 6.4349619829956904e-06, 1.3932438296593748e-05, 2.0681257444575258e-05, 2.6606431921308062e-05, 3.1652941623720695e-05, 3.5785740882826223e-05, 3.8989381058840429e-05, 4.126727287052994e-05, 4.2640618427624816e-05, 4.3147047928795276e-05, 4.2839000117721169e-05, 4.1781888815897691e-05, 4.0052100151439573e-05, 3.7734866474867545e-05, 3.4922063409739145e-05, 3.1709976058339673e-05, 2.8197079115782832e-05, 2.4481873598435841e-05, 2.0660820134894325e-05, 1.6826405379823752e-05, 1.3065374180715234e-05, 9.4571557486109325e-06, 6.0725073535803546e-06, 2.9723940834723512e-06, 2.0711806945961305e-07, -2.1842946083839909e-06, -4.1744462737819984e-06, -5.7476612272222963e-06, -6.8998273140827434e-06, -7.637996789280011e-06, -7.9797619524209265e-06, -7.9524247876477664e-06, -7.5919831410353323e-06, -6.941958766077525e-06, -6.0520948348810563e-06, -4.9769522293226605e-06, -3.7744350823556351e-06, -2.5042766338218733e-06, -1.2265165052400941e-06, -2.3035669289843903e-20, 1.1190709773849026e-06, 2.0785072865694044e-06, 2.8313960502360503e-06, 3.3372344875325201e-06, 3.5629129955667498e-06, 3.483529415623926e-06, 3.0830197019838887e-06, 2.3545936956420433e-06, 1.3009683366130124e-06, -6.5605630122715771e-08, -1.7235236456349554e-06, -3.6422104847778761e-06} \
  CONFIG.Sample_Frequency 2 \
  CONFIG.Clock_Frequency 100.0 \
  CONFIG.Quantization Quantize_Only \
  CONFIG.Coefficient_Fractional_Bits 21 \
  CONFIG.Data_Sign Signed \
  CONFIG.Data_Width 20 \
  CONFIG.Data_Fractional_Bits 0 \
  CONFIG.Output_Rounding_Mode Symmetric_Rounding_to_Infinity \
  CONFIG.Output_Width 16 \
] [get_bd_cells fir_compiler_1]
create_bd_cell -type ip -vlnv TD:user:switch_port:1.0 switch_port_2
set_property -dict {CONFIG.D_WIDTH 16} [get_bd_cells switch_port_2]
create_bd_cell -type ip -vlnv xilinx.com:ip:xlslice:1.0 xlslice_12
set_property -dict {CONFIG.DIN_TO 2 CONFIG.DIN_FROM 2 CONFIG.DIN_WIDTH 4} [get_bd_cells xlslice_12]
create_bd_cell -type ip -vlnv xilinx.com:ip:mult_gen:12.0 mult_gen_1
set_property -dict [list \
  CONFIG.PortAType Signed \
  CONFIG.PortAWidth 8 \
  CONFIG.PortBType Signed \
  CONFIG.PortBWidth 12 \
] [get_bd_cells mult_gen_1]
create_bd_cell -type ip -vlnv xilinx.com:ip:dds_compiler:6.0 dds_compiler_0
set_property -dict [list \
  CONFIG.DDS_Clock_Rate 2 \
  CONFIG.Parameter_Entry Hardware_Parameters \
  CONFIG.Noise_Shaping None \
  CONFIG.Phase_Width 16 \
  CONFIG.Output_Width 8 \
  CONFIG.Phase_Increment Programmable \
  CONFIG.Output_Selection Sine \
  CONFIG.Has_Phase_Out false \
  CONFIG.PINC1 10110101110 \
] [get_bd_cells dds_compiler_0]
create_bd_cell -type ip -vlnv xilinx.com:ip:xlslice:1.0 xlslice_14
set_property -dict {CONFIG.DIN_TO 3 CONFIG.DIN_FROM 3 CONFIG.DIN_WIDTH 4} [get_bd_cells xlslice_14]
create_bd_cell -type ip -vlnv xilinx.com:ip:xlconcat:2.1 xlconcat_3
set_property -dict {CONFIG.IN0_WIDTH 12 CONFIG.IN1_WIDTH 4} [get_bd_cells xlconcat_3]
create_bd_cell -type ip -vlnv xilinx.com:ip:xlconstant:1.1 xlconstant_0
set_property -dict {CONFIG.CONST_WIDTH 4 CONFIG.CONST_VAL 0000} [get_bd_cells xlconstant_0]
create_bd_cell -type ip -vlnv xilinx.com:ip:xlslice:1.0 xlslice_16
set_property -dict {CONFIG.DIN_FROM 7 CONFIG.DIN_WIDTH 16} [get_bd_cells xlslice_16]
create_bd_cell -type ip -vlnv xilinx.com:ip:fir_compiler:7.2 fir_compiler_0
set_property -dict [list \
  CONFIG.CoefficientVector {0.00013423414522688271, -5.334344396203163e-19, -0.00023730769637231368, 1.9272734392210348e-18, 0.00037827312836758397, -4.5605959414447222e-18, -0.00056497348767699143, -6.6524208956162675e-19, 0.00080610715309721332, -2.3269662020704888e-18, -0.0011113021375053057, 7.5917460998604122e-18, 0.0014912357721885605, -3.7758510053270045e-18, -0.0019578247430122324, -3.2766029684200641e-18, 0.0025245216327402769, -5.5846682958908142e-18, -0.003206771479361885, 1.938542685003352e-17, 0.0040227096917998546, -7.6937867240607556e-18, -0.0049942288013433284, -1.0875043125276742e-17, 0.0061486207028816093, -1.0000469961775069e-17, -0.0075211420916269228, 4.0685004759972696e-17, 0.0091591127828539558, -1.236563207345874e-17, -0.011128666948845834, 1.3519684145300434e-17, 0.013526328363306689, -1.462619189385913e-17, -0.016499893611716589, 1.5663748672949855e-17, 0.020288623312434764, -1.6611657340949776e-17, -0.025307284878051013, 1.745052652424643e-17, 0.032342222240129018, -1.8162839867653187e-17, -0.043083458085687421, 1.8733477973417758e-17, 0.061933655436539281, -1.9150174213710797e-17, -0.10505251869785484, 1.9403887846482163e-17, 0.31793253870851212, 0.49995437917795377, 0.31793253870851212, 1.9403887846482163e-17, -0.10505251869785484, -1.9150174213710797e-17, 0.061933655436539281, 1.8733477973417758e-17, -0.043083458085687421, -1.8162839867653187e-17, 0.032342222240129018, 1.745052652424643e-17, -0.025307284878051013, -1.6611657340949776e-17, 0.020288623312434764, 1.5663748672949855e-17, -0.016499893611716589, -1.462619189385913e-17, 0.013526328363306689, 1.3519684145300434e-17, -0.011128666948845845, -1.236563207345874e-17, 0.0091591127828539558, 4.0685004759972696e-17, -0.0075211420916269228, -1.0000469961775069e-17, 0.0061486207028816093, -1.0875043125276742e-17, -0.0049942288013433284, -7.6937867240607556e-18, 0.0040227096917998546, 1.938542685003352e-17, -0.0032067714793618837, -5.5846682958908166e-18, 0.0025245216327402791, -3.2766029684200641e-18, -0.0019578247430122324, -3.7758510053270045e-18, 0.0014912357721885605, 7.5917460998604122e-18, -0.0011113021375053051, -2.3269662020704877e-18, 0.00080610715309721299, -6.6524208956162607e-19, -0.00056497348767699078, -4.5605959414447276e-18, 0.00037827312836758424, 1.9272734392210359e-18, -0.00023730769637231381, -5.3343443962031659e-19, 0.00013423414522688277} \
  CONFIG.Number_Paths 2 \
  CONFIG.Sample_Frequency 2 \
  CONFIG.Clock_Frequency 100.0 \
  CONFIG.Quantization Quantize_Only \
  CONFIG.Coefficient_Fractional_Bits 16 \
  CONFIG.Data_Sign Signed \
  CONFIG.Data_Width 24 \
  CONFIG.Data_Fractional_Bits 0 \
  CONFIG.Output_Rounding_Mode Non_Symmetric_Rounding_Up \
  CONFIG.Output_Width 40 \
  CONFIG.Filter_Selection 1 \
] [get_bd_cells fir_compiler_0]
create_bd_cell -type ip -vlnv xilinx.com:ip:mult_gen:12.0 mult_gen_2
set_property -dict [list \
  CONFIG.PortAType Signed \
  CONFIG.PortAWidth 16 \
  CONFIG.PortBType Signed \
  CONFIG.PortBWidth 8 \
] [get_bd_cells mult_gen_2]
create_bd_cell -type ip -vlnv xilinx.com:ip:xlslice:1.0 xlslice_9
set_property -dict {CONFIG.DIN_TO 4 CONFIG.DIN_FROM 15 CONFIG.DIN_WIDTH 24} [get_bd_cells xlslice_9]
create_bd_cell -type ip -vlnv xilinx.com:ip:xlconcat:2.1 xlconcat_1
set_property -dict {CONFIG.IN0_WIDTH 12 CONFIG.IN1_WIDTH 4} [get_bd_cells xlconcat_1]
create_bd_cell -type ip -vlnv xilinx.com:ip:mult_gen:12.0 mult_gen_3
set_property -dict [list \
  CONFIG.PortAType Signed \
  CONFIG.PortAWidth 40 \
  CONFIG.PortBType Signed \
  CONFIG.PortBWidth 8 \
] [get_bd_cells mult_gen_3]
create_bd_cell -type ip -vlnv xilinx.com:ip:mult_gen:12.0 mult_gen_4
set_property -dict [list \
  CONFIG.PortAType Signed \
  CONFIG.PortAWidth 40 \
  CONFIG.PortBType Signed \
  CONFIG.PortBWidth 8 \
] [get_bd_cells mult_gen_4]
create_bd_cell -type ip -vlnv xilinx.com:ip:xlslice:1.0 xlslice_10
set_property -dict {CONFIG.DIN_FROM 39 CONFIG.DIN_WIDTH 80} [get_bd_cells xlslice_10]
create_bd_cell -type ip -vlnv xilinx.com:ip:xlslice:1.0 xlslice_11
set_property -dict {CONFIG.DIN_TO 8 CONFIG.DIN_FROM 15 CONFIG.DIN_WIDTH 16} [get_bd_cells xlslice_11]
create_bd_cell -type ip -vlnv xilinx.com:ip:xlslice:1.0 xlslice_15
set_property -dict {CONFIG.DIN_TO 40 CONFIG.DIN_FROM 79 CONFIG.DIN_WIDTH 80} [get_bd_cells xlslice_15]
create_bd_cell -type ip -vlnv xilinx.com:ip:xlslice:1.0 xlslice_17
set_property -dict {CONFIG.DIN_TO 8 CONFIG.DIN_FROM 39 CONFIG.DIN_WIDTH 48} [get_bd_cells xlslice_17]
create_bd_cell -type ip -vlnv xilinx.com:ip:xlslice:1.0 xlslice_18
set_property -dict {CONFIG.DIN_TO 8 CONFIG.DIN_FROM 39 CONFIG.DIN_WIDTH 48} [get_bd_cells xlslice_18]
create_bd_cell -type ip -vlnv xilinx.com:ip:xlconcat:2.1 xlconcat_4
set_property -dict {CONFIG.IN0_WIDTH 32 CONFIG.IN1_WIDTH 32} [get_bd_cells xlconcat_4]
create_bd_cell -type ip -vlnv TD:user:switch_port:1.0 switch_port_3
create_bd_cell -type ip -vlnv xilinx.com:ip:xlconcat:2.1 xlconcat_5
set_property -dict {CONFIG.IN0_WIDTH 16 CONFIG.IN1_WIDTH 16} [get_bd_cells xlconcat_5]
create_bd_cell -type ip -vlnv xilinx.com:ip:xlslice:1.0 xlslice_21
set_property -dict {CONFIG.DIN_TO 16 CONFIG.DIN_FROM 31} [get_bd_cells xlslice_21]
create_bd_cell -type ip -vlnv xilinx.com:ip:xlconstant:1.1 xlconstant_3
set_property -dict {CONFIG.CONST_WIDTH 12 CONFIG.CONST_VAL 111111111111} [get_bd_cells xlconstant_3]
create_bd_cell -type ip -vlnv xilinx.com:ip:xlslice:1.0 xlslice_13
set_property -dict {CONFIG.DIN_TO 2 CONFIG.DIN_FROM 2 CONFIG.DIN_WIDTH 8} [get_bd_cells xlslice_13]
create_bd_cell -type ip -vlnv xilinx.com:ip:xlconcat:2.1 xlconcat_7
set_property -dict {CONFIG.IN0_WIDTH 20 CONFIG.IN1_WIDTH 4} [get_bd_cells xlconcat_7]

# ---- connections ----

connect_bd_intf_net [get_bd_intf_pins processing_system7_0/M_AXI_GP0] [get_bd_intf_pins processing_system7_0_axi_periph/S00_AXI]
connect_bd_intf_net [get_bd_intf_pins processing_system7_0_axi_periph/M01_AXI] [get_bd_intf_pins axi_fifo_mm_s_0/S_AXI]
connect_bd_intf_net [get_bd_intf_pins processing_system7_0_axi_periph/M02_AXI] [get_bd_intf_pins axi_gpio_0/S_AXI]
connect_bd_intf_net [get_bd_intf_pins axi_fifo_mm_s_0/AXI_STR_RXD] [get_bd_intf_pins axi_fifo_mm_s_0/AXI_STR_TXC]
connect_bd_intf_net [get_bd_intf_pins processing_system7_0_axi_periph/M00_AXI] [get_bd_intf_pins axi_gpio_1/S_AXI]
connect_bd_intf_net [get_bd_intf_pins processing_system7_0_axi_periph/M04_AXI] [get_bd_intf_pins axi_gpio_3/S_AXI]
connect_bd_intf_net [get_bd_intf_pins processing_system7_0_axi_periph/M03_AXI] [get_bd_intf_pins axi_gpio_2/S_AXI]
connect_bd_intf_net [get_bd_intf_pins processing_system7_0_axi_periph/M05_AXI] [get_bd_intf_pins axi_gpio_4/S_AXI]
connect_bd_intf_net [get_bd_intf_pins processing_system7_0_axi_periph/M06_AXI] [get_bd_intf_pins axi_gpio_5/S_AXI]
connect_bd_intf_net [get_bd_intf_pins processing_system7_0_axi_periph/M07_AXI] [get_bd_intf_pins axi_gpio_6/S_AXI]
connect_bd_intf_net [get_bd_intf_pins processing_system7_0_axi_periph/M08_AXI] [get_bd_intf_pins axi_gpio_7/S_AXI]
connect_bd_intf_net [get_bd_intf_ports DDR] [get_bd_intf_pins processing_system7_0/DDR]
connect_bd_intf_net [get_bd_intf_ports FIXED_IO] [get_bd_intf_pins processing_system7_0/FIXED_IO]
connect_bd_intf_net [get_bd_intf_ports GPIO] [get_bd_intf_pins axi_gpio_0/GPIO]
connect_bd_intf_net [get_bd_intf_ports IIC_0] [get_bd_intf_pins processing_system7_0/IIC_0]
connect_bd_net [get_bd_pins processing_system7_0/FCLK_RESET0_N] [get_bd_pins rst_processing_system7_0_100M/ext_reset_in]
connect_bd_net [get_bd_pins rst_processing_system7_0_100M/peripheral_aresetn] \
  [get_bd_pins axi_gpio_0/s_axi_aresetn] [get_bd_pins axi_fifo_mm_s_0/s_axi_aresetn] [get_bd_pins axi_gpio_1/s_axi_aresetn] \
  [get_bd_pins axi_gpio_3/s_axi_aresetn] [get_bd_pins axi_gpio_2/s_axi_aresetn] [get_bd_pins axi_gpio_4/s_axi_aresetn] \
  [get_bd_pins axi_gpio_5/s_axi_aresetn] [get_bd_pins clk_wiz_0/resetn] [get_bd_pins ac_interface_0/reset] \
  [get_bd_pins cic_compiler_0/aresetn] [get_bd_pins axi_gpio_6/s_axi_aresetn] [get_bd_pins axi_gpio_7/s_axi_aresetn] \
  [get_bd_pins processing_system7_0_axi_periph/S00_ARESETN] [get_bd_pins processing_system7_0_axi_periph/M00_ARESETN] \
  [get_bd_pins processing_system7_0_axi_periph/M01_ARESETN] [get_bd_pins processing_system7_0_axi_periph/M02_ARESETN] \
  [get_bd_pins processing_system7_0_axi_periph/M03_ARESETN] [get_bd_pins processing_system7_0_axi_periph/M04_ARESETN] \
  [get_bd_pins processing_system7_0_axi_periph/M05_ARESETN] [get_bd_pins processing_system7_0_axi_periph/M06_ARESETN] \
  [get_bd_pins processing_system7_0_axi_periph/M07_ARESETN] [get_bd_pins processing_system7_0_axi_periph/M08_ARESETN]
connect_bd_net [get_bd_pins rst_processing_system7_0_100M/interconnect_aresetn] [get_bd_pins processing_system7_0_axi_periph/ARESETN]
connect_bd_net [get_bd_pins axi_gpio_0/ip2intc_irpt] [get_bd_pins processing_system7_0/IRQ_F2P]
connect_bd_net [get_bd_pins processing_system7_0/FCLK_CLK0] \
  [get_bd_pins axi_gpio_0/s_axi_aclk] [get_bd_pins processing_system7_0/M_AXI_GP0_ACLK] \
  [get_bd_pins rst_processing_system7_0_100M/slowest_sync_clk] [get_bd_pins axi_fifo_mm_s_0/s_axi_aclk] \
  [get_bd_pins axi_gpio_1/s_axi_aclk] [get_bd_pins axi_gpio_3/s_axi_aclk] [get_bd_pins axi_gpio_2/s_axi_aclk] \
  [get_bd_pins axi_gpio_4/s_axi_aclk] [get_bd_pins axi_gpio_5/s_axi_aclk] [get_bd_pins clk_wiz_0/clk_in1] \
  [get_bd_pins cic_compiler_0/aclk] [get_bd_pins cordic_0/aclk] [get_bd_pins cmpy_0/aclk] [get_bd_pins mult_gen_0/CLK] \
  [get_bd_pins switch_port_0/aclk] [get_bd_pins c_addsub_0/CLK] [get_bd_pins axi_gpio_6/s_axi_aclk] \
  [get_bd_pins axi_gpio_7/s_axi_aclk] [get_bd_pins switch_port_1/aclk] [get_bd_pins fir_compiler_1/aclk] \
  [get_bd_pins switch_port_2/aclk] [get_bd_pins mult_gen_1/CLK] [get_bd_pins fir_compiler_0/aclk] \
  [get_bd_pins mult_gen_2/CLK] [get_bd_pins mult_gen_3/CLK] [get_bd_pins mult_gen_4/CLK] [get_bd_pins switch_port_3/aclk] \
  [get_bd_pins processing_system7_0_axi_periph/ACLK] [get_bd_pins processing_system7_0_axi_periph/S00_ACLK] \
  [get_bd_pins processing_system7_0_axi_periph/M00_ACLK] [get_bd_pins processing_system7_0_axi_periph/M01_ACLK] \
  [get_bd_pins processing_system7_0_axi_periph/M02_ACLK] [get_bd_pins processing_system7_0_axi_periph/M03_ACLK] \
  [get_bd_pins processing_system7_0_axi_periph/M04_ACLK] [get_bd_pins processing_system7_0_axi_periph/M05_ACLK] \
  [get_bd_pins processing_system7_0_axi_periph/M06_ACLK] [get_bd_pins processing_system7_0_axi_periph/M07_ACLK] \
  [get_bd_pins processing_system7_0_axi_periph/M08_ACLK]
connect_bd_net [get_bd_pins xlconstant_1/dout] \
  [get_bd_pins dds_compiler_1/s_axis_config_tvalid] [get_bd_pins cic_compiler_0/s_axis_data_tvalid] \
  [get_bd_pins cordic_0/s_axis_cartesian_tvalid] [get_bd_pins cmpy_0/s_axis_b_tvalid] [get_bd_pins cmpy_0/s_axis_a_tvalid] \
  [get_bd_pins fir_compiler_1/s_axis_data_tvalid] [get_bd_pins dds_compiler_0/s_axis_config_tvalid] \
  [get_bd_pins fir_compiler_0/s_axis_data_tvalid]
connect_bd_net [get_bd_pins clk_wiz_0/clk_out1] [get_bd_pins xadc_channel_14_0/clk130]
connect_bd_net -net vauxn14_1 [get_bd_ports vauxn14] [get_bd_pins xadc_channel_14_0/vauxn14]
connect_bd_net -net vauxp14_1 [get_bd_ports vauxp14] [get_bd_pins xadc_channel_14_0/vauxp14]
connect_bd_net [get_bd_pins clk_wiz_0/clk_out2] [get_bd_ports AC_MCLK] [get_bd_pins ac_interface_0/mclk]
connect_bd_net [get_bd_pins ac_interface_0/led] [get_bd_ports led_tri_o]
connect_bd_net [get_bd_pins ac_interface_0/AC_BCLK] [get_bd_ports AC_BCLK]
connect_bd_net [get_bd_pins ac_interface_0/AC_MUTEN] [get_bd_ports AC_MUTEN]
connect_bd_net [get_bd_pins ac_interface_0/AC_PBDAT] [get_bd_ports AC_PBDAT]
connect_bd_net [get_bd_pins ac_interface_0/AC_LRCLK] [get_bd_ports AC_RECLRC] [get_bd_ports AC_PBLRC]
connect_bd_net [get_bd_ports AC_RECDAT] [get_bd_pins ac_interface_0/AC_RECDAT]
connect_bd_net [get_bd_pins axi_gpio_3/gpio_io_o] [get_bd_pins dds_compiler_1/s_axis_config_tdata]
connect_bd_net -net xlslice_5_Dout [get_bd_pins xlslice_0/Dout] [get_bd_pins ac_interface_0/play_parallel] [get_bd_pins axi_gpio_1/gpio_io_i]
connect_bd_net [get_bd_pins dds_compiler_1/m_axis_data_tdata] [get_bd_pins xlslice_7/Din] [get_bd_pins xlslice_6/Din]
connect_bd_net [get_bd_pins xlslice_3/Dout] [get_bd_pins dds_compiler_1/aclk] [get_bd_pins delayz1z2_0/aclkFs]
connect_bd_net [get_bd_pins cordic_0/m_axis_dout_tdata] [get_bd_pins xlslice_5/Din] [get_bd_pins xlslice_2/Din]
connect_bd_net [get_bd_pins xlconcat_0/dout] [get_bd_pins cmpy_0/s_axis_a_tdata]
connect_bd_net [get_bd_pins xlconcat_2/dout] [get_bd_pins cmpy_0/s_axis_b_tdata]
connect_bd_net -net xlconcat_3_dout [get_bd_pins switch_port_2/data_out] [get_bd_pins xlconcat_0/In0] [get_bd_pins xlconcat_2/In0]
connect_bd_net [get_bd_pins c_counter_binary_0/Q] [get_bd_pins xlslice_3/Din] [get_bd_pins xlslice_13/Din]
connect_bd_net [get_bd_pins clk_wiz_0/clk_out3] [get_bd_pins c_counter_binary_0/CLK]
connect_bd_net [get_bd_pins mult_gen_0/P] [get_bd_pins xlslice_0/Din]
connect_bd_net [get_bd_pins xlslice_1/Dout] [get_bd_pins mult_gen_0/B]
connect_bd_net [get_bd_pins axi_gpio_4/gpio2_io_o] [get_bd_pins xlslice_1/Din]
connect_bd_net [get_bd_pins cic_compiler_0/m_axis_data_tdata] [get_bd_pins mult_gen_0/A]
connect_bd_net [get_bd_pins xlslice_5/Dout] [get_bd_pins switch_port_0/data_in1]
connect_bd_net [get_bd_pins xlslice_2/Dout] [get_bd_pins delayz1z2_0/data_in]
connect_bd_net [get_bd_pins delayz1z2_0/data_out_1] [get_bd_pins c_addsub_0/A]
connect_bd_net [get_bd_pins delayz1z2_0/data_out_2] [get_bd_pins c_addsub_0/B]
